# Altium schematic sheet power1.SchDoc
size A
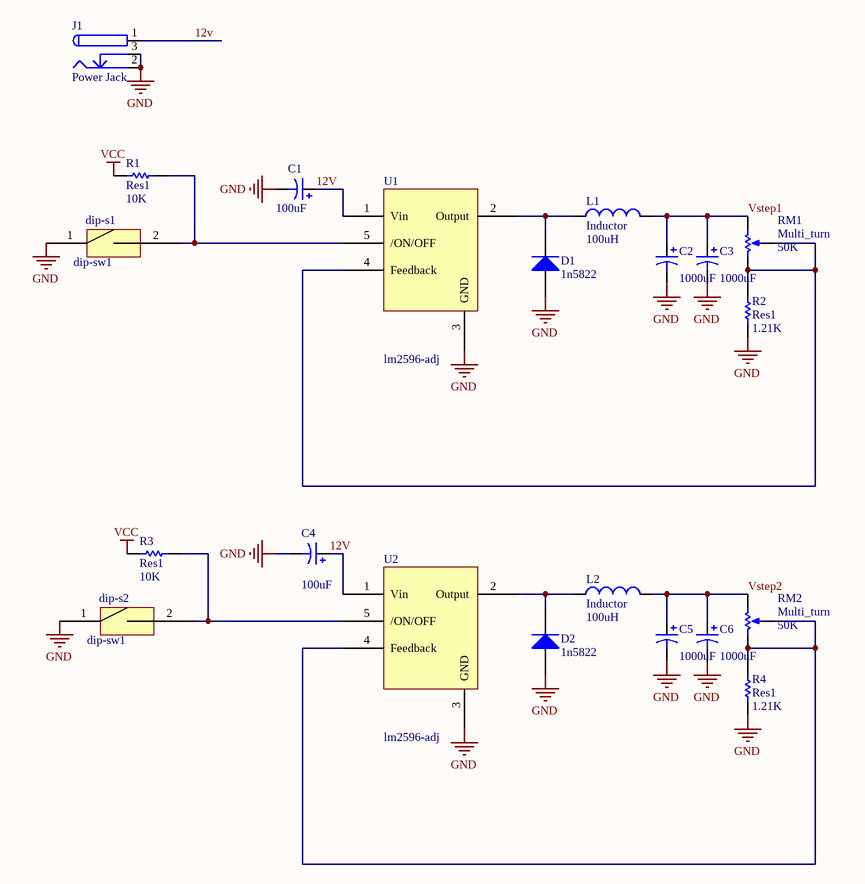
[diagram p0: power1.SchDoc]

## Parts
C1  value 100uF  [CAP ALUM 6.6MM]
C2  value 1000uF  [CAP ALUM 10.3MM]
C3  value 1000uF  [CAP ALUM 10.3MM]
C4  value 100uF  [CAP ALUM 6.6MM]
C5  value 1000uF  [CAP ALUM 10.3MM]
C6  value 1000uF  [CAP ALUM 10.3MM]
D1  1n5822  [DO214AC SMA]
D2  1n5822  [DO214AC SMA]
dip-s1  dip-sw1  [DIP2]
dip-s2  dip-sw1  [DIP2]
J1  Power Jack  [Power Jack]
L1  Inductor  value 100uH  [inductor - 12x12x7]
L2  Inductor  value 100uH  [inductor - 12x12x7]
R1  Res1  value 10K  [RES 1206/3216]
R2  Res1  value 1.21K  [RES 1206/3216]
R3  Res1  value 10K  [RES 1206/3216]
R4  Res1  value 1.21K  [RES 1206/3216]
RM1  Multi_turn  value 50K  [Multi Turn 02]
RM2  Multi_turn  value 50K  [Multi Turn 02]
U1  lm2596-adj  [DPAK170P1430X238-6N]
U2  lm2596-adj  [DPAK170P1430X238-6N]

## Nets
GND: C1.2 C2.2 C3.2 C4.2 C5.2 C6.2 D1.1(A) D2.1(A) dip-s1.1(k) dip-s2.1(k) J1.2 J1.3 R2.1 R4.1 U1.3(GND) U2.3(GND)
VCC: R1.2 R3.2
12V: C1.1 C4.1 J1.1 U1.1(Vin) U2.1(Vin)
Vstep1: C2.1 C3.1 L1.2 RM1.1(TOP)
Vstep2: C5.1 C6.1 L2.2 RM2.1(TOP)
NetD1_2: D1.2(K) L1.1 U1.2(Output)
NetD2_2: D2.2(K) L2.1 U2.2(Output)
Netdip-s1_2: dip-s1.2(k) R1.1 U1.5(/ON/OFF)
Netdip-s2_2: dip-s2.2(k) R3.1 U2.5(/ON/OFF)
NetR2_2: R2.2 RM1.2(BOT) RM1.3(TAP) U1.4(Feedback)
NetR4_2: R4.2 RM2.2(BOT) RM2.3(TAP) U2.4(Feedback)

## Library data of the parts
C1-C6 = Cap Pol1: Polarized Capacitor (Radial); Published: 8-Jun-2000; LatestRevisionDate: 17-Jul-2002; LatestRevisionNote: Re-released for DXP Platform.; PackageReference: RB7.6-15; Publisher: Altium Limited; PackageDescription: Polarized Capacitor (Radial); 2 Leads
D1 D2 = Diode 1N4007: 1 Amp General Purpose Rectifier; Published: 8-Jun-2000; LatestRevisionDate: 17-Jul-2002; LatestRevisionNote: Re-released for DXP Platform.; DatasheetVersion: 1998; PackageVersion: Aug-1999; PackageReference: DO-41; Publisher: Altium Limited; PackageDescription: Diode, Axial; Body 5.2 x 2.7 mm (LxDia. max), Lead Dia. 0.86 mm (max); Code_JEDEC: DO-204-AL; ComponentLink1Description: Manufacturer Link; ComponentLink1URL: http://www.fairchildsemi.com/; ComponentLink2Description: Datasheet; ComponentLink2URL: http://www.fairchildsemi.com/ds/1N%2F1N4001.pdf
J1 = Power Jack: Designer: Saeid Jorablo; Company: Personal; Project Name: Laser; Adding Date: 10/21/2009
L1 L2 = Inductor: Code_IEC: 1005; Published: 8-Jun-2000; LatestRevisionDate: 29-May-2009; LatestRevisionNote: IPC-7351 Footprint Added.; PackageReference: 0402-A; Publisher: Altium Limited; PackageDescription: Chip Inductor; Code_JEITA: 0402
R1-R4 = Res1: Resistor; Published: 8-Jun-2000; LatestRevisionDate: 17-Jul-2002; LatestRevisionNote: Re-released for DXP Platform.; PackageReference: AXIAL-0.3; Publisher: Altium Limited; PackageDescription: Axial Device, Thru-Hole; 2 Leads; 0.3 in Pin Spacing
RM1 RM2 = Multi_turn: Potentiometer; Sim Note: Enter the Resistance value and the set point into parameter fields.; Set Position: 0.5; Published: 8-Jun-2000; LatestRevisionDate: 17-Jul-2002; LatestRevisionNote: Re-released for DXP Platform.; PackageReference: VR5; Publisher: Altium Limited
U1 U2 = lm2596